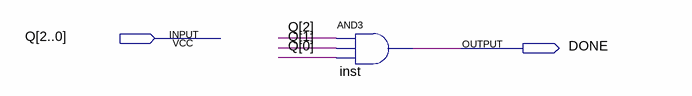
[diagram p0: schematic sheet]
// Quartus schematic Y.bdf as structural Verilog: 1 symbols, 2 pins
module Y (
  input  [2:0] Q,
  output DONE
);

  and inst (DONE, Q[2], Q[1], Q[0]);
endmodule
